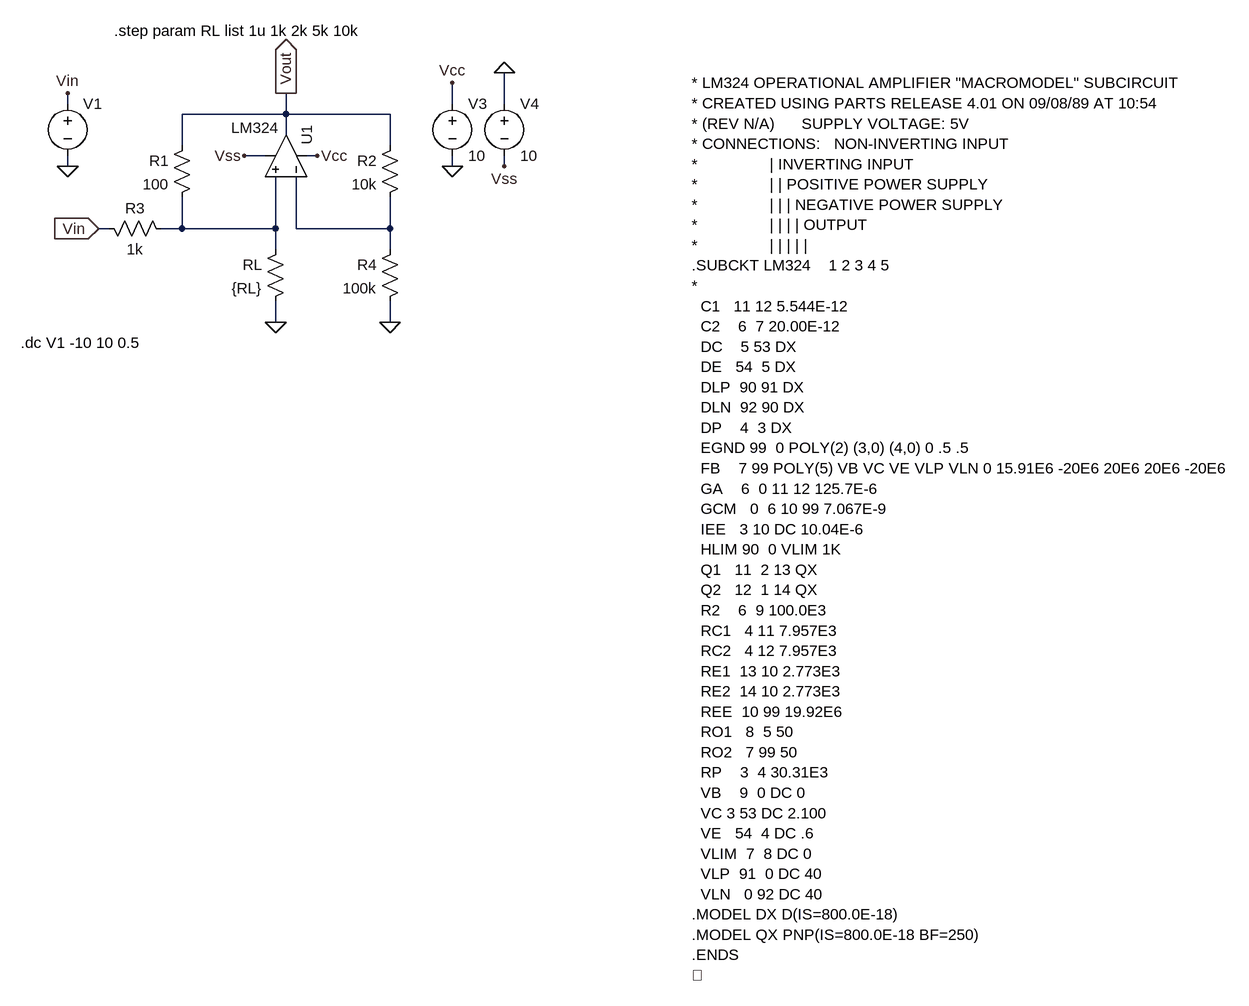
[diagram p0: schematic L1_C2.asc]
L1_C2.asc, the LTspice schematic file:
Version 4
SHEET 1 1504 1184
WIRE -224 -32 -224 -48
WIRE 368 -32 368 -64
WIRE 448 -32 448 -80
WIRE 112 -16 112 -48
WIRE 112 -16 -48 -16
WIRE 272 -16 112 -16
WIRE 112 16 112 -16
WIRE -48 32 -48 -16
WIRE 272 32 272 -16
WIRE 80 48 48 48
WIRE 160 48 144 48
WIRE -224 64 -224 48
WIRE 368 64 368 48
WIRE 448 64 448 48
WIRE -160 160 -176 160
WIRE -48 160 -48 112
WIRE -48 160 -80 160
WIRE 96 160 96 80
WIRE 96 160 -48 160
WIRE 128 160 128 80
WIRE 272 160 272 112
WIRE 272 160 128 160
WIRE 96 192 96 160
WIRE 272 192 272 160
WIRE 96 304 96 272
WIRE 272 304 272 272
FLAG -224 64 0
FLAG 368 64 0
FLAG -176 160 Vin
IOPIN -176 160 In
FLAG -224 -48 Vin
FLAG 448 -80 0
FLAG 368 -64 Vcc
FLAG 160 48 Vcc
FLAG 448 64 Vss
FLAG 48 48 Vss
FLAG 112 -48 Vout
IOPIN 112 -48 Out
FLAG 96 304 0
FLAG 272 304 0
SYMBOL res -32 16 M0
SYMATTR InstName R1
SYMATTR Value 100
SYMBOL res 288 16 M0
SYMATTR InstName R2
SYMATTR Value 10k
SYMBOL res -64 176 M270
WINDOW 0 32 56 VTop 2
WINDOW 3 0 56 VBottom 2
SYMATTR InstName R3
SYMATTR Value 1k
SYMBOL res 288 176 M0
SYMATTR InstName R4
SYMATTR Value 100k
SYMBOL voltage -224 -48 R0
WINDOW 123 0 0 Left 0
WINDOW 39 0 0 Left 0
WINDOW 3 -50 -37 VRight 2
SYMATTR Value ""
SYMATTR InstName V1
SYMBOL voltage 368 -48 R0
WINDOW 123 0 0 Left 0
WINDOW 39 0 0 Left 0
SYMATTR InstName V3
SYMATTR Value 10
SYMBOL voltage 448 -48 R0
WINDOW 123 0 0 Left 0
WINDOW 39 0 0 Left 0
SYMATTR InstName V4
SYMATTR Value 10
SYMBOL res 112 176 M0
SYMATTR InstName RL
SYMATTR Value {RL}
SYMBOL OpAmps\\opamp2 176 48 M270
WINDOW 3 43 148 VLeft 2
SYMATTR Value LM324
SYMATTR InstName U1
TEXT -152 -144 Left 2 !.step param RL list 1u 1k 2k 5k 10k
TEXT 736 -64 Left 2 !* LM324 OPERATIONAL AMPLIFIER "MACROMODEL" SUBCIRCUIT\n* CREATED USING PARTS RELEASE 4.01 ON 09/08/89 AT 10:54\n* (REV N/A)      SUPPLY VOLTAGE: 5V\n* CONNECTIONS:   NON-INVERTING INPUT\n*                | INVERTING INPUT\n*                | | POSITIVE POWER SUPPLY\n*                | | | NEGATIVE POWER SUPPLY\n*                | | | | OUTPUT\n*                | | | | |\n.SUBCKT LM324    1 2 3 4 5\n*\n  C1   11 12 5.544E-12\n  C2    6  7 20.00E-12\n  DC    5 53 DX\n  DE   54  5 DX\n  DLP  90 91 DX\n  DLN  92 90 DX\n  DP    4  3 DX\n  EGND 99  0 POLY(2) (3,0) (4,0) 0 .5 .5\n  FB    7 99 POLY(5) VB VC VE VLP VLN 0 15.91E6 -20E6 20E6 20E6 -20E6\n  GA    6  0 11 12 125.7E-6\n  GCM   0  6 10 99 7.067E-9\n  IEE   3 10 DC 10.04E-6\n  HLIM 90  0 VLIM 1K\n  Q1   11  2 13 QX\n  Q2   12  1 14 QX\n  R2    6  9 100.0E3\n  RC1   4 11 7.957E3\n  RC2   4 12 7.957E3\n  RE1  13 10 2.773E3\n  RE2  14 10 2.773E3\n  REE  10 99 19.92E6\n  RO1   8  5 50\n  RO2   7 99 50\n  RP    3  4 30.31E3\n  VB    9  0 DC 0\n  VC 3 53 DC 2.100\n  VE   54  4 DC .6\n  VLIM  7  8 DC 0\n  VLP  91  0 DC 40\n  VLN   0 92 DC 40\n.MODEL DX D(IS=800.0E-18)\n.MODEL QX PNP(IS=800.0E-18 BF=250)\n.ENDS\n
TEXT -296 336 Left 2 !.dc V1 -10 10 0.5

The netlist it stands for:
* L1_C2.asc
R1 Vout N001 100
R2 Vout N002 10k
R3 N001 Vin 1k
R4 N002 0 100k
V1 Vin 0
V3 Vcc 0 10
V4 0 Vss 10
RL N001 0 {RL}
XU1 N001 N002 Vcc Vss Vout LM324  ; pins In+ In- V+ V- OUT
.step param RL list 1u 1k 2k 5k 10k
* LM324 OPERATIONAL AMPLIFIER "MACROMODEL" SUBCIRCUIT
* CREATED USING PARTS RELEASE 4.01 ON 09/08/89 AT 10:54
* (REV N/A)      SUPPLY VOLTAGE: 5V
* CONNECTIONS:   NON-INVERTING INPUT
*                | INVERTING INPUT
*                | | POSITIVE POWER SUPPLY
*                | | | NEGATIVE POWER SUPPLY
*                | | | | OUTPUT
*                | | | | |
.SUBCKT LM324    1 2 3 4 5
*
  C1   11 12 5.544E-12
  C2    6  7 20.00E-12
  DC    5 53 DX
  DE   54  5 DX
  DLP  90 91 DX
  DLN  92 90 DX
  DP    4  3 DX
  EGND 99  0 POLY(2) (3,0) (4,0) 0 .5 .5
  FB    7 99 POLY(5) VB VC VE VLP VLN 0 15.91E6 -20E6 20E6 20E6 -20E6
  GA    6  0 11 12 125.7E-6
  GCM   0  6 10 99 7.067E-9
  IEE   3 10 DC 10.04E-6
  HLIM 90  0 VLIM 1K
  Q1   11  2 13 QX
  Q2   12  1 14 QX
  R2    6  9 100.0E3
  RC1   4 11 7.957E3
  RC2   4 12 7.957E3
  RE1  13 10 2.773E3
  RE2  14 10 2.773E3
  REE  10 99 19.92E6
  RO1   8  5 50
  RO2   7 99 50
  RP    3  4 30.31E3
  VB    9  0 DC 0
  VC 3 53 DC 2.100
  VE   54  4 DC .6
  VLIM  7  8 DC 0
  VLP  91  0 DC 40
  VLN   0 92 DC 40
.MODEL DX D(IS=800.0E-18)
.MODEL QX PNP(IS=800.0E-18 BF=250)
.ENDS

.dc V1 -10 10 0.5
.backanno
.end

* Results of the author's LTspice run, read from the files saved beside the schematic
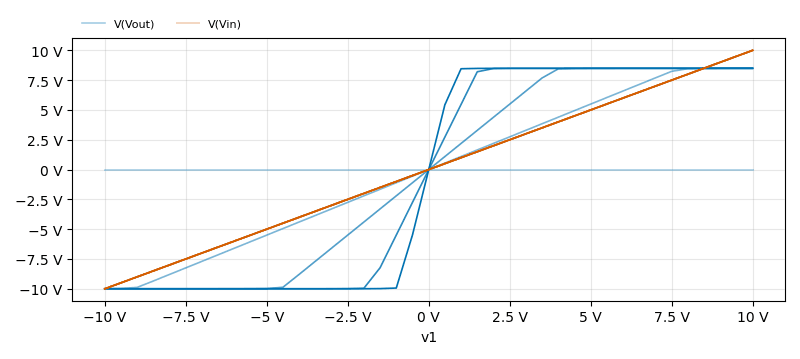
[diagram p1: DC transfer characteristic of L1_C2.asc, plotted from the saved traces]
* DC transfer characteristic, 5 runs:
*   V(Vout) [rl=1e-06]: -236.4 µV at v1=-10 V, -236.4 µV at v1=10 V, min -236.4 µV, max -236.4 µV
*   V(Vout) [rl=1000]: -9.99 V at v1=-10 V, 8.494 V at v1=10 V, min -9.99 V, max 8.494 V
*   V(Vout) [rl=2000]: -9.996 V at v1=-10 V, 8.494 V at v1=10 V, min -9.996 V, max 8.494 V
*   V(Vout) [rl=5000]: -9.996 V at v1=-10 V, 8.494 V at v1=10 V, min -9.996 V, max 8.494 V
*   V(Vout) [rl=10000]: -9.996 V at v1=-10 V, 8.494 V at v1=10 V, min -9.996 V, max 8.494 V
*   V(Vin) [rl=1e-06]: -10 V at v1=-10 V, 10 V at v1=10 V, min -10 V, max 10 V
*   V(Vin) [rl=1000]: -10 V at v1=-10 V, 10 V at v1=10 V, min -10 V, max 10 V
*   V(Vin) [rl=2000]: -10 V at v1=-10 V, 10 V at v1=10 V, min -10 V, max 10 V
*   V(Vin) [rl=5000]: -10 V at v1=-10 V, 10 V at v1=10 V, min -10 V, max 10 V
*   V(Vin) [rl=10000]: -10 V at v1=-10 V, 10 V at v1=10 V, min -10 V, max 10 V